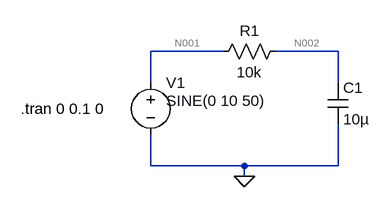
[diagram p0: schematic Draft1.asc]
Draft1.asc, the LTspice schematic file:
Version 4
SHEET 1 880 680
WIRE 160 80 48 80
WIRE 336 80 240 80
WIRE 48 128 48 80
WIRE 336 128 336 80
WIRE 48 256 48 208
WIRE 192 256 48 256
WIRE 336 256 336 192
WIRE 336 256 192 256
WIRE 192 272 192 256
FLAG 192 272 0
SYMBOL voltage 48 112 R0
WINDOW 3 24 44 Left 2
WINDOW 123 24 124 Left 2
WINDOW 39 0 0 Left 0
SYMATTR InstName V1
SYMATTR Value SINE(0 10 50)
SYMBOL res 256 64 R90
WINDOW 0 0 56 VBottom 2
WINDOW 3 32 56 VTop 2
SYMATTR InstName R1
SYMATTR Value 10k
SYMBOL cap 320 128 R0
SYMATTR InstName C1
SYMATTR Value 10µ
TEXT -152 168 Left 2 !.tran 0 0.1 0

The netlist it stands for:
* Draft1.asc
V1 N001 0 SINE(0 10 50)
R1 N002 N001 10k
C1 N002 0 10µ
.tran 0 0.1 0
.backanno
.end

* Results of the author's LTspice run, read from the files saved beside the schematic
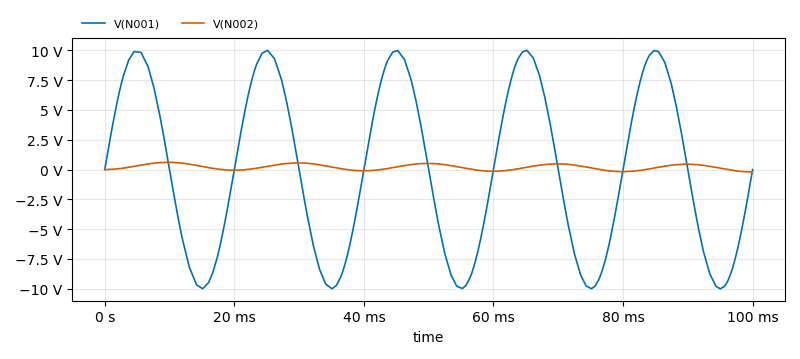
[diagram p1: Transient Analysis of Draft1.asc, plotted from the saved traces]
* Transient Analysis, 1 run:
*   V(N001): min -10 V, max 9.992 V, average -1.133 mV, rms 7.054 V, last 0 V
*   V(N002): min -201 mV, max 606.2 mV, average 200.6 mV, rms 307.2 mV, last -201 mV